# Altium schematic sheet Motor.SchDoc
size A
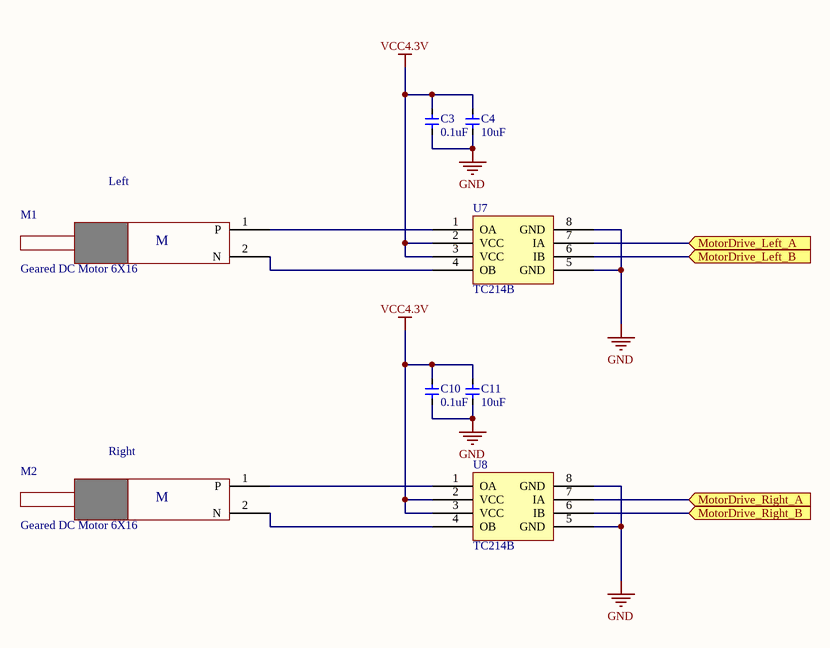
[diagram p0: Motor.SchDoc]

## Parts
C3  value 0.1uF  [CAP_0603]  (hidden comment: Cap_0603)
C4  value 10uF  [CAP_0603]  (hidden comment: Cap_0603)
C10  value 0.1uF  [CAP_0603]  (hidden comment: Cap_0603)
C11  value 10uF  [CAP_0603]  (hidden comment: Cap_0603)
M1  Geared DC Motor 6X16  [Geared_DC_Motor_6X16]
M2  Geared DC Motor 6X16  [Geared_DC_Motor_6X16]
U7  TC214B  [SOP_E150_8]
U8  TC214B  [SOP_E150_8]

## Ports
MotorDrive_Left_A (in), MotorDrive_Left_B (in), MotorDrive_Right_A (in), MotorDrive_Right_B (in)

## Nets
GND: C3.1 C4.1 C10.1 C11.1 U7.5(GND) U7.8(GND) U8.5(GND) U8.8(GND)
VCC4.3V: C3.2 C4.2 C10.2 C11.2 U7.2(VCC) U7.3(VCC) U8.2(VCC) U8.3(VCC)
MotorDrive_Left_A: U7.7(IA) ; port MotorDrive_Left_A
MotorDrive_Left_B: U7.6(IB) ; port MotorDrive_Left_B
MotorDrive_Right_A: U8.7(IA) ; port MotorDrive_Right_A
MotorDrive_Right_B: U8.6(IB) ; port MotorDrive_Right_B
NetM1_1: M1.1(P) U7.1(OA)
NetM1_2: M1.2(N) U7.4(OB)
NetM2_1: M2.1(P) U8.1(OA)
NetM2_2: M2.2(N) U8.4(OB)

## Notes on the sheet
- Left
- Right
- (in symbol GearMotor_DC_6X16) M

## Library data of the parts
C3 C4 C10 C11 = Cap_0603: Capacitor
M1 M2 = GearMotor_DC_6X16: Geared DC Motor, 6mm D, L=16mm
U7 U8 = TC214B: DC Motor Driver 1 Channel  (Cheap Replacement of L9110)